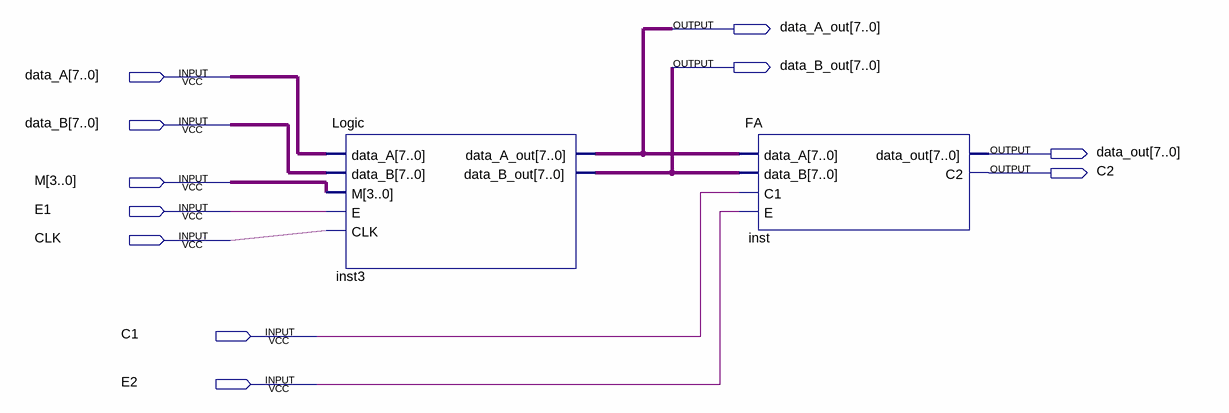
[diagram p0: schematic sheet]
// Quartus schematic CPU.bdf as structural Verilog: 2 symbols, 11 pins
module CPU (
  input  [7:0] data_A,
  input  [7:0] data_B,
  input  [3:0] M,
  input  E1,
  input  CLK,
  input  C1,
  input  E2,
  output [7:0] data_A_out,
  output [7:0] data_B_out,
  output [7:0] data_out,
  output C2
);

  Logic inst3 (
    .data_A(data_A), .data_B(data_B), .M(M), .E(E1), .CLK(CLK), .data_A_out(data_A_out),
    .data_B_out(data_B_out));
  FA inst (.data_A(data_A_out), .data_B(data_B_out), .C1(C1), .E(E2), .data_out(data_out), .C2(C2));
endmodule
